# EAGLE design switch_hub (EAGLE 6.2)
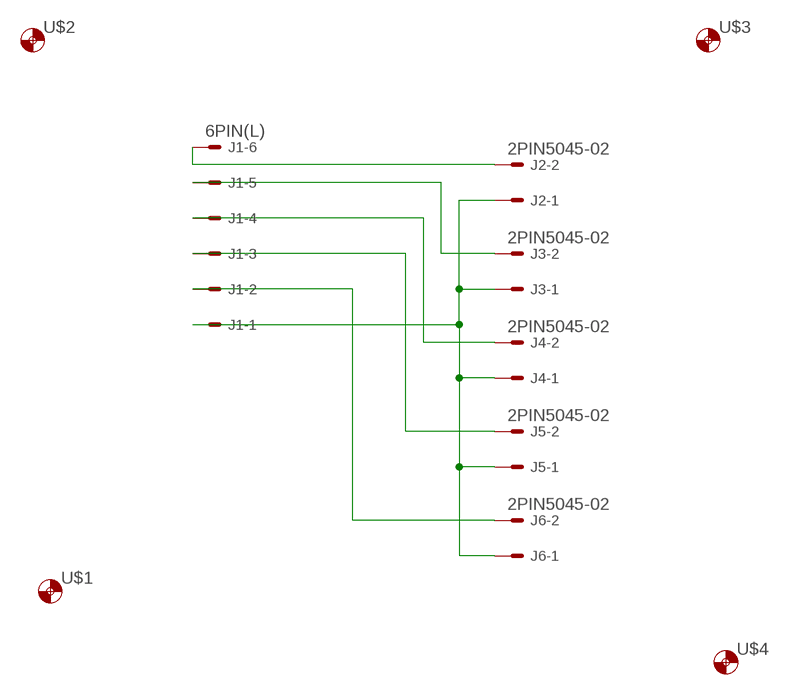
[diagram p0: schematic, sheet 1]

## Parts
J1  6PIN(L)  [6PL]
J2  2PIN5045-02  [5045-02]
J3  2PIN5045-02  [5045-02]
J4  2PIN5045-02  [5045-02]
J5  2PIN5045-02  [5045-02]
J6  2PIN5045-02  [5045-02]
U$1  1MMDRILL  [1MDRILL]
U$2  1MMDRILL  [1MDRILL]
U$3  1MMDRILL  [1MDRILL]
U$4  1MMDRILL  [1MDRILL]

## Nets
N$1: J1.1 J2.P$2 J3.P$2 J4.P$2 J5.P$2 J6.P$2
N$2: J1.6 J2.P$1
N$3: J1.5 J3.P$1
N$4: J1.4 J4.P$1
N$5: J1.3 J5.P$1
N$6: J1.2 J6.P$1

## Library data of the parts
J1 = my_connector:6PIN(L)
J2-J6 = 5051:2PIN
U$1-U$4 = Orig_Lib:1MMDRILL

## Board
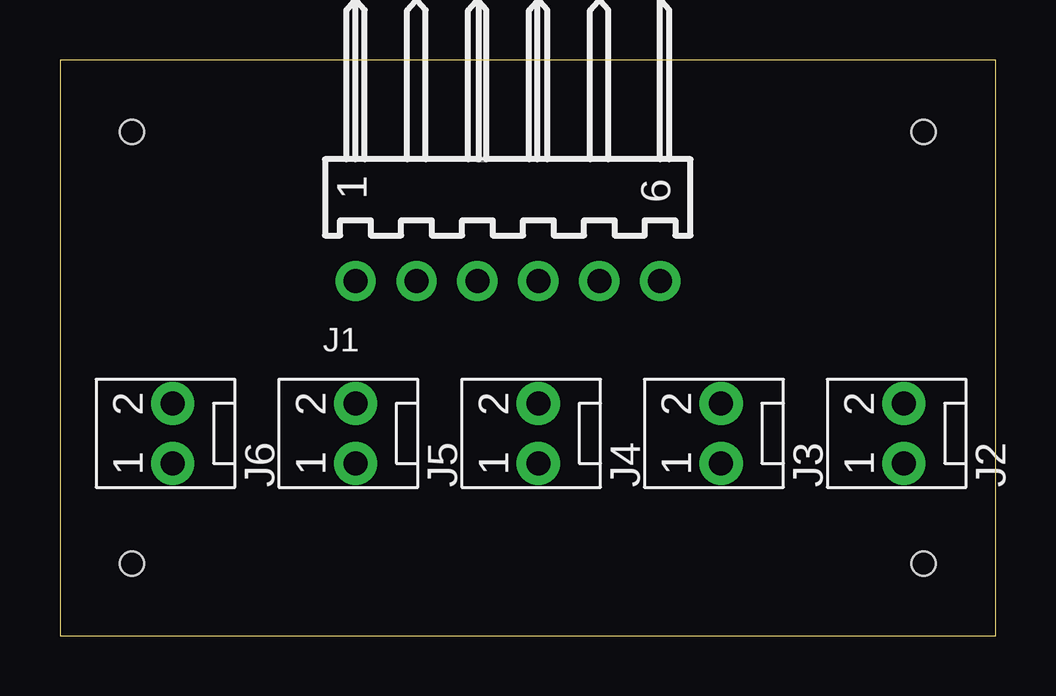
[diagram p1: board, top side]
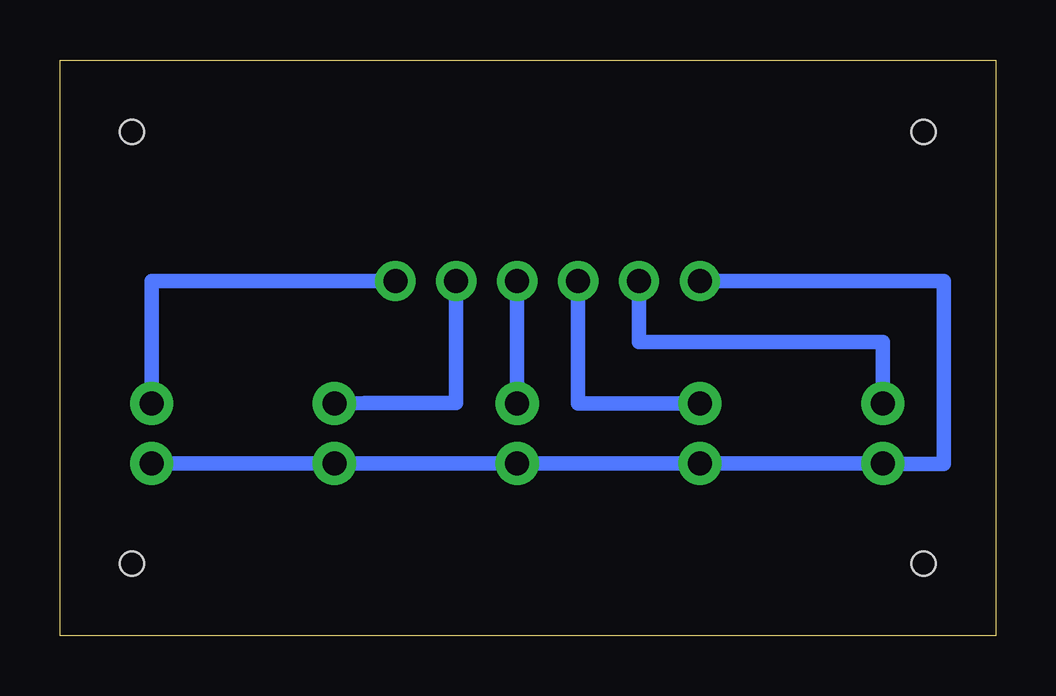
[diagram p2: board, bottom side, seen from below]

Size 39 x 24 mm. Coordinates in mm from the lower left corner, seen from the top.
Outline: 0,0 39,0 39,24 0,24 0,0
Copper layers (1*16): Top 0.035mm / dielectric 1.5mm / Bottom 0.035mm
Design rules: minimum track width 10mil, minimum drill 24mil, track to track 8mil, track to pad 8mil, pad to pad 8mil, via to via 8mil, smd to smd 8mil, copper to edge 40mil, drill to drill 8mil, minimum pad ring 10mil, minimum via ring 8mil, stop-mask expansion 4mil, vias tented up to drill 0mil, thermal gap 10mil

### Footprints (pad centres in the part's own frame; a part is rotated, then mirrored left to right if it is on the bottom)
6PL = drill 1 pad 1.676: 1 -6.35,-6.35; 2 -3.81,-6.35; 3 -1.27,-6.35; 4 1.27,-6.35; 5 3.81,-6.35; 6 6.35,-6.35
5045-02 = drill 1 pad 1.8: P$1 -1.25,0; P$2 1.25,0
1MDRILL = hole 1: 0,0

### Placement (x,y rotation side)
J1  18.67,21.13 0 top
J2  35.18,8.43 270 top
J3  27.56,8.43 270 top
J4  19.94,8.43 270 top
J5  12.32,8.43 270 top
J6  4.7,8.43 270 top
U$1  3,21 0 top
U$2  3,3 0 top
U$3  36,3 0 top
U$4  36,21 0 top

### Tracks (layer width: path | path; a pad name or v marks a point on that pad's centre or on a via)
N$1
  Bottom 0.61: J1.1 2.16,14.78 2.16,7.16 4.7,7.16 J6.P$2 J5.P$2 J4.P$2 J3.P$2 J2.P$2 | J2.P$2 35.18,7.16 J2.P$2
N$2
  Bottom 0.61: J1.6 35.18,14.78 J2.P$1
N$3
  Bottom 0.61: J3.P$1 26.29,9.7 22.48,9.7 J1.5
N$4
  Bottom 0.61: J4.P$1 J1.4
N$5
  Bottom 0.61: J5.P$1 17.4,9.68 J1.3
N$6
  Bottom 0.61: J6.P$1 4.7,12.24 14.86,12.24 J1.2